# Altium schematic sheet yyb_v2_Leds.SchDoc: Extension connectors
size A4; DocumentNumber: MB1136; Revision: C.3; SheetNumber: 4; SheetTotal: 4; Project: NUCLEO-XXXXRX
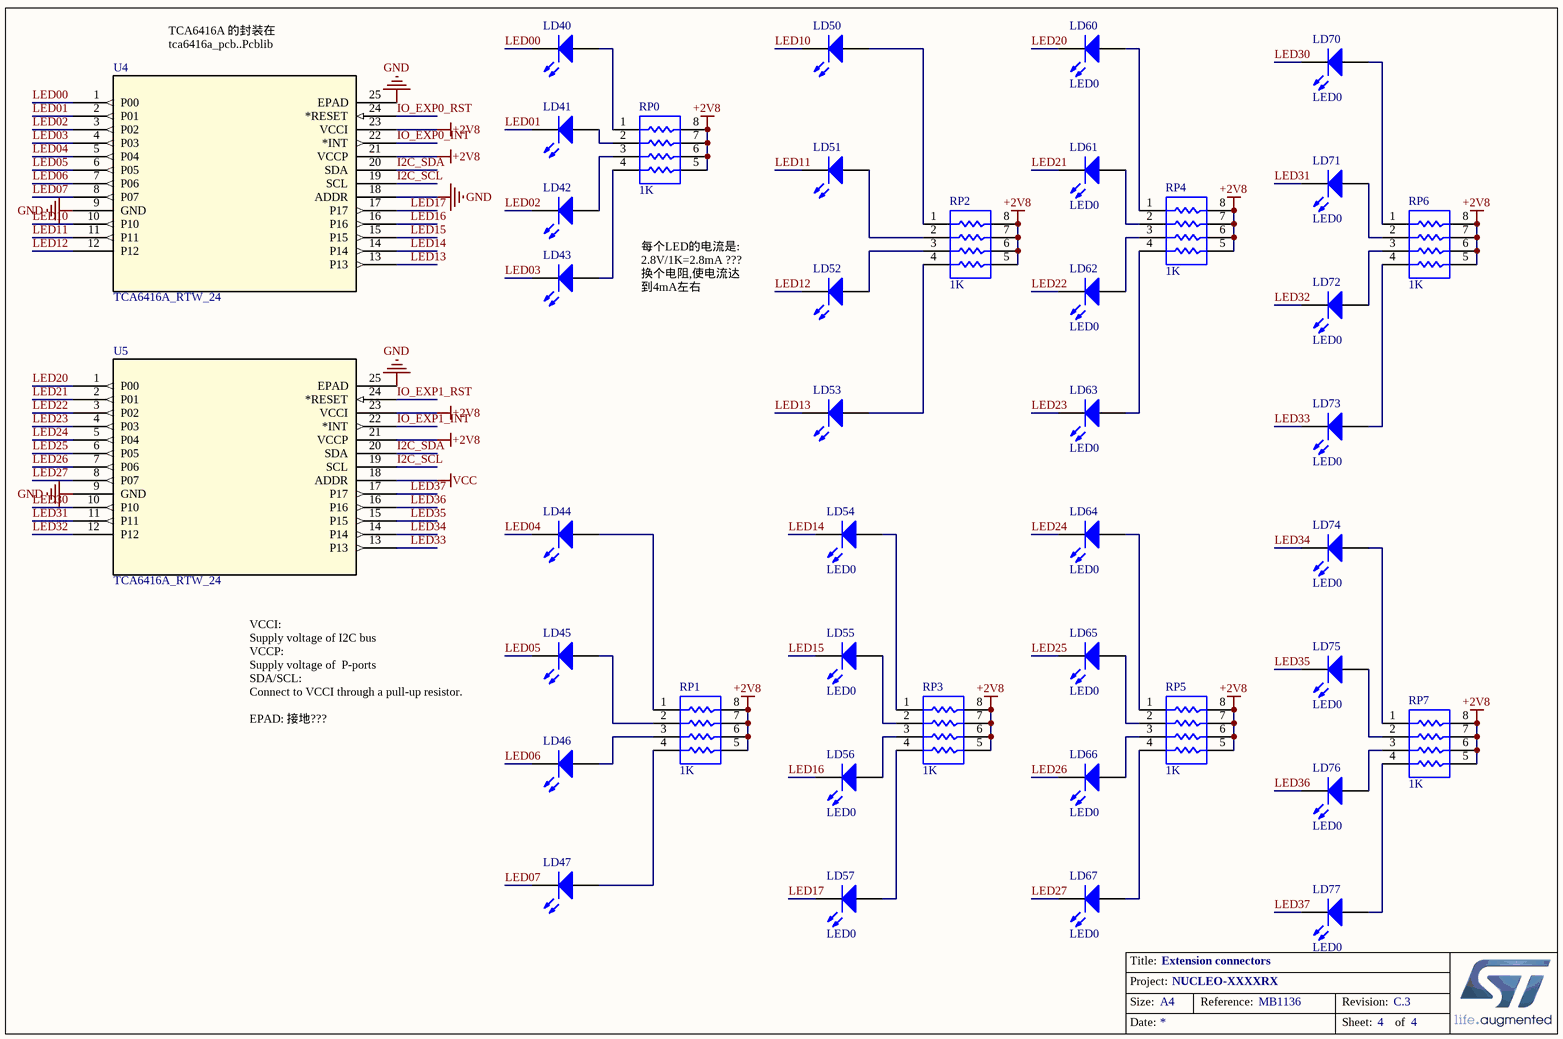
[diagram p0: yyb_v2_Leds.SchDoc]

## Parts
LD40  LED0  [LED5]  (value not drawn)
LD41  LED0  [LED5]  (value not drawn)
LD42  LED0  [LED5]  (value not drawn)
LD43  LED0  [LED5]  (value not drawn)
LD44  LED0  [LED-0]  (value not drawn)
LD45  LED0  [LED-0]  (value not drawn)
LD46  LED0  [LED-0]  (value not drawn)
LD47  LED0  [LED-0]  (value not drawn)
LD50  LED0  [LED-0]  (value not drawn)
LD51  LED0  [LED-0]  (value not drawn)
LD52  LED0  [LED-0]  (value not drawn)
LD53  LED0  [LED-0]  (value not drawn)
LD54  LED0  [LED5]
LD55  LED0  [LED5]
LD56  LED0  [LED5]
LD57  LED0  [LED5]
LD60  LED0  [LED5]
LD61  LED0  [LED5]
LD62  LED0  [LED5]
LD63  LED0  [LED5]
LD64  LED0  [LED5]
LD65  LED0  [LED5]
LD66  LED0  [LED5]
LD67  LED0  [LED5]
LD70  LED0  [LED5]
LD71  LED0  [LED5]
LD72  LED0  [LED5]
LD73  LED0  [LED5]
LD74  LED0  [LED5]
LD75  LED0  [LED5]
LD76  LED0  [LED5]
LD77  LED0  [LED5]
RP0  1K  [4P8]
RP1  1K  [4P8]
RP2  1K  [4P8]
RP3  1K  [4P8]
RP4  1K  [4P8]
RP5  1K  [4P8]
RP6  1K  [4P8]
RP7  1K  [4P8]
U4  TCA6416A_RTW_24  [RTW24_2P45X2P45]
U5  TCA6416A_RTW_24  [RTW24_2P45X2P45]

## Nets
+2V8: RP0.5 RP0.6 RP0.7 RP0.8 RP1.5 RP1.6 RP1.7 RP1.8 RP2.5 RP2.6 RP2.7 RP2.8 RP3.5 RP3.6 RP3.7 RP3.8 RP4.5 RP4.6 RP4.7 RP4.8 RP5.5 RP5.6 RP5.7 RP5.8 RP6.5 RP6.6 RP6.7 RP6.8 RP7.5 RP7.6 RP7.7 RP7.8 U4.21(VCCP) U4.23(VCCI) U5.21(VCCP) U5.23(VCCI)
GND: U4.9(GND) U4.18(ADDR) U4.25(EPAD) U5.9(GND) U5.25(EPAD)
VCC: U5.18(ADDR)
I2C_SCL: U4.19(SCL) U5.19(SCL)
I2C_SDA: U4.20(SDA) U5.20(SDA)
IO_EXP0_INT: U4.22(*INT)
IO_EXP0_RST: U4.24(*RESET)
IO_EXP1_INT: U5.22(*INT)
IO_EXP1_RST: U5.24(*RESET)
LED00: LD40.2(K) U4.1(P00)
LED01: LD41.2(K) U4.2(P01)
LED02: LD42.2(K) U4.3(P02)
LED03: LD43.2(K) U4.4(P03)
LED04: LD44.2(K) U4.5(P04)
LED05: LD45.2(K) U4.6(P05)
LED06: LD46.2(K) U4.7(P06)
LED07: LD47.2(K) U4.8(P07)
LED10: LD50.2(K) U4.10(P10)
LED11: LD51.2(K) U4.11(P11)
LED12: LD52.2(K) U4.12(P12)
LED13: LD53.2(K) U4.13(P13)
LED14: LD54.2(K) U4.14(P14)
LED15: LD55.2(K) U4.15(P15)
LED16: LD56.2(K) U4.16(P16)
LED17: LD57.2(K) U4.17(P17)
LED20: LD60.2(K) U5.1(P00)
LED21: LD61.2(K) U5.2(P01)
LED22: LD62.2(K) U5.3(P02)
LED23: LD63.2(K) U5.4(P03)
LED24: LD64.2(K) U5.5(P04)
LED25: LD65.2(K) U5.6(P05)
LED26: LD66.2(K) U5.7(P06)
LED27: LD67.2(K) U5.8(P07)
LED30: LD70.2(K) U5.10(P10)
LED31: LD71.2(K) U5.11(P11)
LED32: LD72.2(K) U5.12(P12)
LED33: LD73.2(K) U5.13(P13)
LED34: LD74.2(K) U5.14(P14)
LED35: LD75.2(K) U5.15(P15)
LED36: LD76.2(K) U5.16(P16)
LED37: LD77.2(K) U5.17(P17)
NetLD40_1: LD40.1(A) RP0.1
NetLD41_1: LD41.1(A) RP0.2
NetLD42_1: LD42.1(A) RP0.3
NetLD43_1: LD43.1(A) RP0.4
NetLD44_1: LD44.1(A) RP1.1
NetLD45_1: LD45.1(A) RP1.2
NetLD46_1: LD46.1(A) RP1.3
NetLD47_1: LD47.1(A) RP1.4
NetLD50_1: LD50.1(A) RP2.1
NetLD51_1: LD51.1(A) RP2.2
NetLD52_1: LD52.1(A) RP2.3
NetLD53_1: LD53.1(A) RP2.4
NetLD54_1: LD54.1(A) RP3.1
NetLD55_1: LD55.1(A) RP3.2
NetLD56_1: LD56.1(A) RP3.3
NetLD57_1: LD57.1(A) RP3.4
NetLD60_1: LD60.1(A) RP4.1
NetLD61_1: LD61.1(A) RP4.2
NetLD62_1: LD62.1(A) RP4.3
NetLD63_1: LD63.1(A) RP4.4
NetLD64_1: LD64.1(A) RP5.1
NetLD65_1: LD65.1(A) RP5.2
NetLD66_1: LD66.1(A) RP5.3
NetLD67_1: LD67.1(A) RP5.4
NetLD70_1: LD70.1(A) RP6.1
NetLD71_1: LD71.1(A) RP6.2
NetLD72_1: LD72.1(A) RP6.3
NetLD73_1: LD73.1(A) RP6.4
NetLD74_1: LD74.1(A) RP7.1
NetLD75_1: LD75.1(A) RP7.2
NetLD76_1: LD76.1(A) RP7.3
NetLD77_1: LD77.1(A) RP7.4

## Notes on the sheet
- (near U4) TCA6416A 的封装在tca6416a_pcb..Pcblib
- 每个LED的电流是:
  2.8V/1K=2.8mA ???
  换个电阻,使电流达到4mA左右
- VCCI:
  Supply voltage of I2C bus
  VCCP:
  Supply voltage of  P-ports
  SDA/SCL:
  Connect to VCCI through a pull-up resistor.
  EPAD: 接地???
- Title:
- Project:
- Size:
- Date:
- A4
- Reference:
- Sheet:
- Revision:
- of

## Library data of the parts
LD40-LD47 LD50-LD57 LD60-LD67 LD70-LD77 = LED0: Typical INFRARED GaAs LED; Published: 8-Jun-2000; LatestRevisionDate: 08-Jul-2005; LatestRevisionNote: Mech Layer 1 removed.; PackageReference: LED-0; Publisher: Altium Limited; PackageDescription: LED; 2 Leads
RP0-RP7 = RESPACK3_1
U4 U5 = TCA6416A_RTW_24: Imported; Manufacturer: Texas Instruments; INDUSTRY_STD_PKG_TYPE: QFN; FAMILY_NAME: I2C IO EXPANDER; PIN_COUNT: 24; PACKAGE_DESIGNATOR: RTW; Datasheet_URL: http://www.ti.com/lit/gpn/TCA6416A; GENERIC_PART_NUMBER: TCA6416A; Vendor: Texas Instruments; Manufacturer_Part_Number: tca6416a_rtw_24; Value: Value; Type: Type; RefDes: RefDes